# EAGLE design PT08pos (EAGLE 6.6.0)

## Sheet 1 of 2
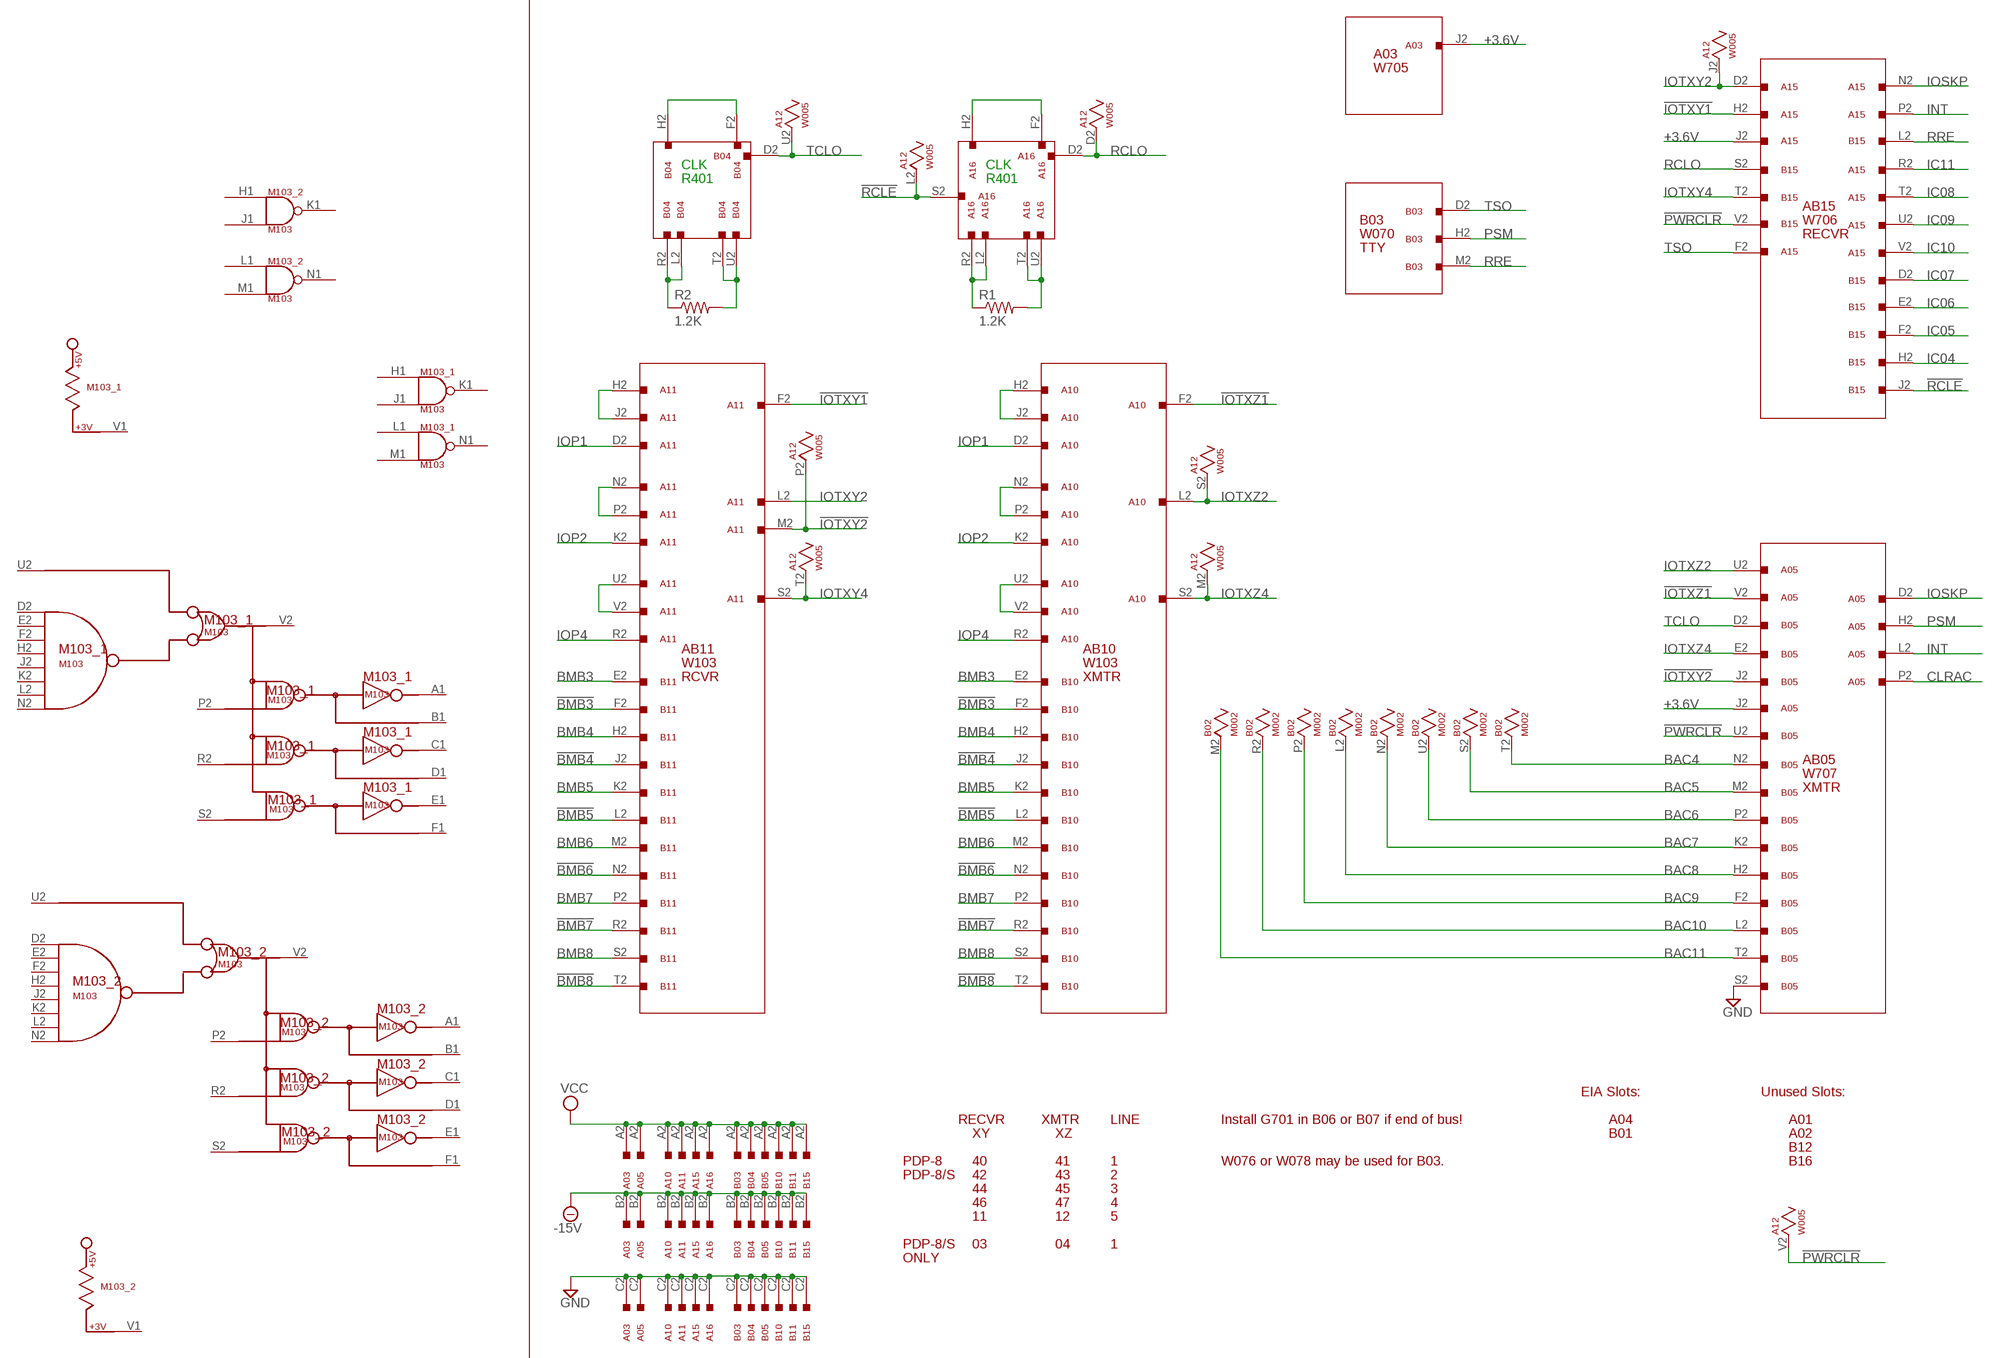
[diagram p0: schematic, sheet 1, part 1 of 2]
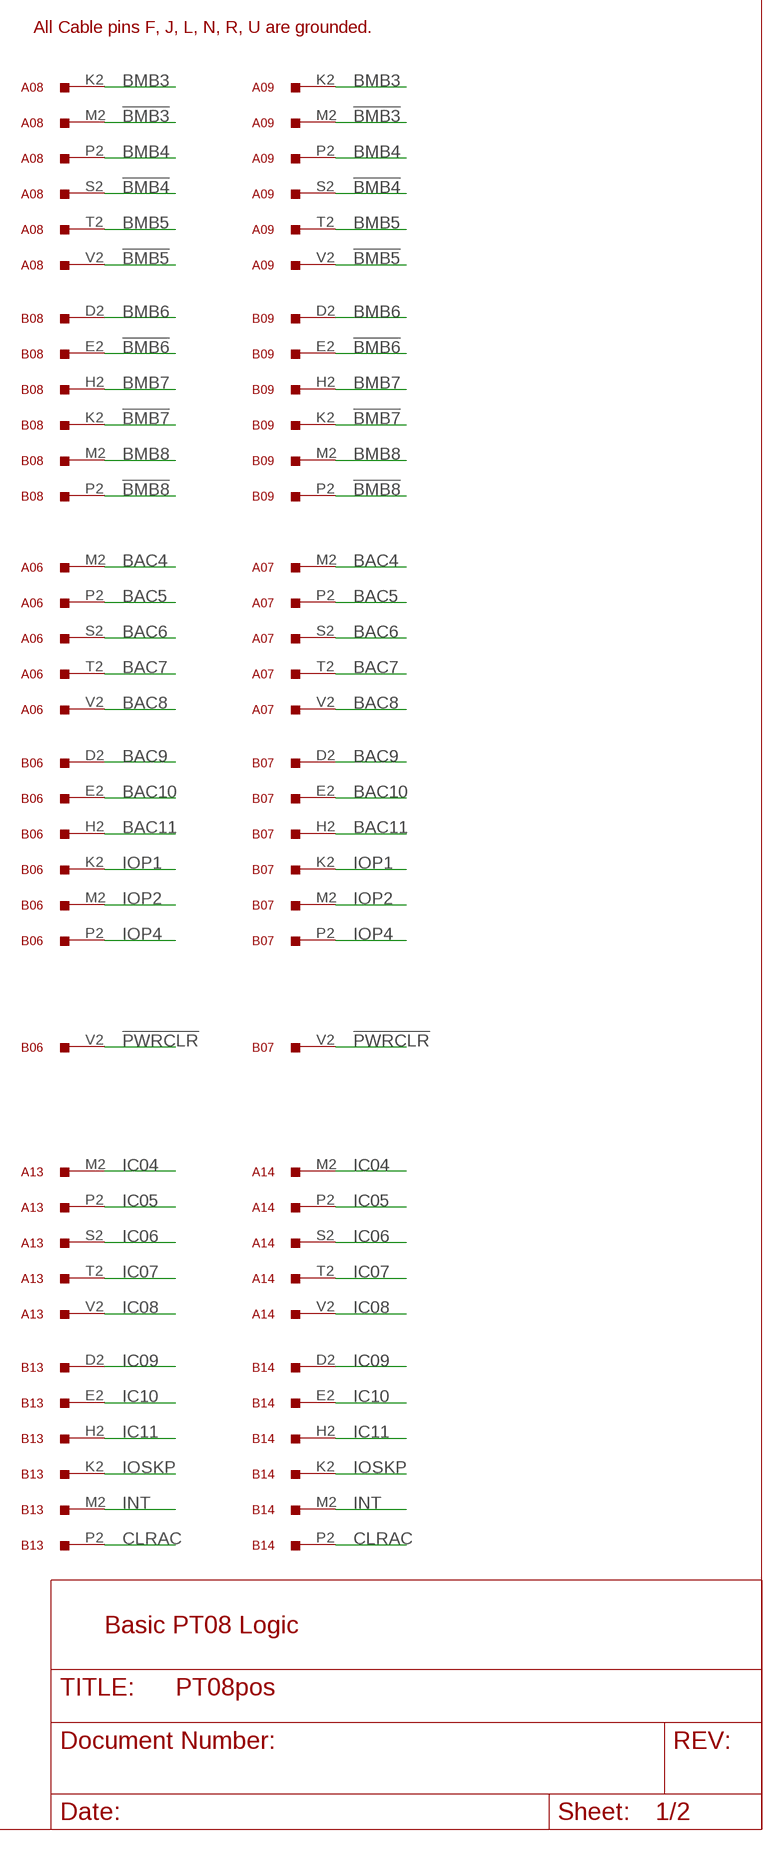
[diagram p1: schematic, sheet 1, part 2 of 2]

### Parts
A01  H807  [H807]
A02  H807  [H807]
A03  W705  W023  [H807]
A05  W707  W023  [H807]
A06  W011  [H807]
A07  W011  [H807]
A08  W011  [H807]
A09  W011  [H807]
A10  W103  W023  [H807]
A11  W103  W023  [H807]
A12  W005  [H807]
A13  W011  [H807]
A14  W011  [H807]
A15  W706  W023  [H807]
A16  R401  W023  [H807]
B02  M002  [H807]
B03  W076  W023  [H807]
B04  R401  W023  [H807]
B05  W707  W023  [H807]
B06  W011  [H807]
B07  W011  [H807]
B08  W011  [H807]
B09  W011  [H807]
B10  W103  W023  [H807]
B11  W103  W023  [H807]
B12  H807  [H807]
B13  W011  [H807]
B14  W011  [H807]
B15  W706  W023  [H807]
B16  H807  [H807]
M103_1  M103  [H807]
M103_2  M103  [H807]
R1  1.2K  R-US_0207/10  [0207/10]
R2  1.2K  R-US_0207/10  [0207/10]

### Nets
!BMB3: A08.M2 A09.M2 B10.F2 B11.F2
!BMB4: A08.S2 A09.S2 B10.J2 B11.J2
!BMB5: A08.V2 A09.V2 B10.L2 B11.L2
!BMB6: B08.E2 B09.E2 B10.N2 B11.N2
!BMB7: B08.K2 B09.K2 B10.R2 B11.R2
!BMB8: B08.P2 B09.P2 B10.T2 B11.T2
!IOTXY1: A11.F2 A15.H2
!IOTXY2: A11.M2 A12.P2 B05.J2
!IOTXZ1: A05.V2 A10.F2
!PWRCLR: A12.V2 B05.U2 B06.V2 B07.V2 B15.V2
!RCLE: A12.L2 A16.S2 B15.J2
+3.6V: A03.J2 A05.J2 A15.J2
-15V [Power]: A03.B2 A05.B2 A10.B2 A11.B2 A15.B2 A16.B2 B03.B2 B04.B2 B05.B2 B10.B2 B11.B2 B15.B2 ; also sheet 2
BAC4: A06.M2 A07.M2 B02.T2 B05.N2
BAC5: A06.P2 A07.P2 B02.S2 B05.M2
BAC6: A06.S2 A07.S2 B02.U2 B05.P2
BAC7: A06.T2 A07.T2 B02.N2 B05.K2
BAC8: A06.V2 A07.V2 B02.L2 B05.H2
BAC9: B02.P2 B05.F2 B06.D2 B07.D2
BAC10: B02.R2 B05.L2 B06.E2 B07.E2
BAC11: B02.M2 B05.T2 B06.H2 B07.H2
BMB3: A08.K2 A09.K2 B10.E2 B11.E2
BMB4: A08.P2 A09.P2 B10.H2 B11.H2
BMB5: A08.T2 A09.T2 B10.K2 B11.K2
BMB6: B08.D2 B09.D2 B10.M2 B11.M2
BMB7: B08.H2 B09.H2 B10.P2 B11.P2
BMB8: B08.M2 B09.M2 B10.S2 B11.S2
CLRAC: A05.P2 B13.P2 B14.P2
GND [Power]: A03.C2 A05.C2 A10.C2 A11.C2 A15.C2 A16.C2 B03.C2 B04.C2 B05.C2 B05.S2 B10.C2 B11.C2 B15.C2 ; also sheet 2
IC04: A13.M2 A14.M2 B15.H2
IC05: A13.P2 A14.P2 B15.F2
IC06: A13.S2 A14.S2 B15.E2
IC07: A13.T2 A14.T2 B15.D2
IC08: A13.V2 A14.V2 A15.T2
IC09: A15.U2 B13.D2 B14.D2
IC10: A15.V2 B13.E2 B14.E2
IC11: A15.R2 B13.H2 B14.H2
INT: A05.L2 A15.P2 B13.M2 B14.M2
IOP1: A10.D2 A11.D2 B06.K2 B07.K2
IOP2: A10.K2 A11.K2 B06.M2 B07.M2
IOP4: A10.R2 A11.R2 B06.P2 B07.P2
IOSKP: A05.D2 A15.N2 B13.K2 B14.K2
IOTXY2: A11.L2 A12.J2 A15.D2
IOTXY4: A11.S2 A12.T2 B15.T2
IOTXZ2: A05.U2 A10.L2 A12.S2
IOTXZ4: A10.S2 A12.M2 B05.E2
N$1: A10.U2 A10.V2
N$2: A16.F2 A16.H2
N$3: A16.L2 A16.R2 R1.1
N$4: A16.T2 A16.U2 R1.2
N$5: A10.H2 A10.J2
N$6: B04.F2 B04.H2
N$7: B04.L2 B04.R2 R2.1
N$8: B04.T2 B04.U2 R2.2
N$9: A11.U2 A11.V2
N$10: A11.H2 A11.J2
N$11: A10.N2 A10.P2
N$12: A11.N2 A11.P2
PSM: A05.H2 B03.H2 ; also sheet 2
RCLO: A12.D2 A16.D2 B15.S2
RRE: B03.M2 B15.L2
TCLO: A12.U2 B04.D2 B05.D2
TSO: A15.F2 B03.D2 ; also sheet 2
VCC [Power]: A03.A2 A05.A2 A10.A2 A11.A2 A15.A2 A16.A2 B03.A2 B04.A2 B05.A2 B10.A2 B11.A2 B15.A2 ; also sheet 2
Unconnected: A03.D2 A03.E2 A03.F2 A03.H2 A03.K2 A03.L2 A03.M2 A03.N2 A03.P2 A03.R2 A03.S2 A03.T2 A03.U2 A03.V2 A05.E2 A05.F2 A05.K2 A05.M2 A05.N2 A05.R2 A05.S2 A05.T2 A06.D2 A06.E2 A06.H2 A06.K2 A07.D2 A07.E2 A07.H2 A07.K2 A08.D2 A08.E2 A08.H2 A09.D2 A09.E2 A09.H2 A10.E2 A10.M2 A10.T2 A11.E2 A11.T2 A12.E2 A12.F2 A12.H2 A12.K2 A12.N2 A12.R2 A13.D2 A13.E2 A13.H2 A13.K2 A14.D2 A14.E2 A14.H2 A14.K2 A15.E2 A15.K2 A15.L2 A15.M2 A15.S2 A16.E2 A16.J2 A16.K2 A16.M2 A16.N2 A16.P2 A16.V2 B02.F2 B02.H2 B02.J2 B02.K2 B02.V2 B03.F2 B03.J2 B03.L2 B03.N2 B03.R2 B03.S2 B03.T2 B03.U2 B03.V2 B04.E2 B04.J2 B04.K2 B04.M2 B04.N2 B04.P2 B04.S2 B04.V2 B05.R2 B05.V2 B06.S2 B06.T2 B07.S2 B07.T2 B08.S2 B08.T2 B08.V2 B09.S2 B09.T2 B09.V2 B10.D2 B10.U2 B10.V2 B11.D2 B11.U2 B11.V2 B13.S2 B13.T2 B13.V2 B14.S2 B14.T2 B14.V2 B15.K2 B15.M2 B15.N2 B15.P2 B15.R2 B15.U2 M103_1.A1(V2:A1) M103_1.B1(V2:B1) M103_1.C1(V2:C1) M103_1.D1(V2:D1) M103_1.D2(V2:D2) M103_1.E1(V2:E1) M103_1.E2(V2:E2) M103_1.F1(V2:F1) M103_1.F2(V2:F2) M103_1.H1(K1:IN1) M103_1.H2(V2:H2) M103_1.J1(K1:IN2) M103_1.J2(V2:J2) M103_1.K1(K1:OUT) M103_1.K2(V2:K2) M103_1.L1(N1:IN1) M103_1.L2(V2:L2) M103_1.M1(N1:IN2) M103_1.N1(N1:OUT) M103_1.N2(V2:N2) M103_1.P2(V2:P2) M103_1.R2(V2:R2) M103_1.S2(V2:S2) M103_1.U2(V2:U2) M103_1.V1 M103_1.V2(V2:V2) M103_2.A1(V2:A1) M103_2.B1(V2:B1) M103_2.C1(V2:C1) M103_2.D1(V2:D1) M103_2.D2(V2:D2) M103_2.E1(V2:E1) M103_2.E2(V2:E2) M103_2.F1(V2:F1) M103_2.F2(V2:F2) M103_2.H1(K1:IN1) M103_2.H2(V2:H2) M103_2.J1(K1:IN2) M103_2.J2(V2:J2) M103_2.K1(K1:OUT) M103_2.K2(V2:K2) M103_2.L1(N1:IN1) M103_2.L2(V2:L2) M103_2.M1(N1:IN2) M103_2.N1(N1:OUT) M103_2.N2(V2:N2) M103_2.P2(V2:P2) M103_2.R2(V2:R2) M103_2.S2(V2:S2) M103_2.U2(V2:U2) M103_2.V1 M103_2.V2(V2:V2)

### Notes on the sheet
- All Cable pins F, J, L, N, R, U are grounded.
- A03
- W705
- CLK | CLK
- R401 | R401
- AB15
- B03 | W706
- W070 | RECVR
- TTY
- AB11 | AB10
- W103 | W103
- RCVR | XMTR
- AB05
- W707
- XMTR
- EIA Slots: | Unused Slots:
- RECVR | XMTR | LINE | Install G701 in B06 or B07 if end of bus! | A04
- XY | XZ | B01
- PDP-8 | 40 | 41 | 1 | W076 or W078 may be used for B03.
- PDP-8/S | 42 | 43 | 2
- 44 | 45 | 3
- 46 | 47 | 4
- 11 | 12 | 5 | Basic PT08 Logic
- PDP-8/S | 03 | 04 | 1
- ONLY

## Sheet 2 of 2
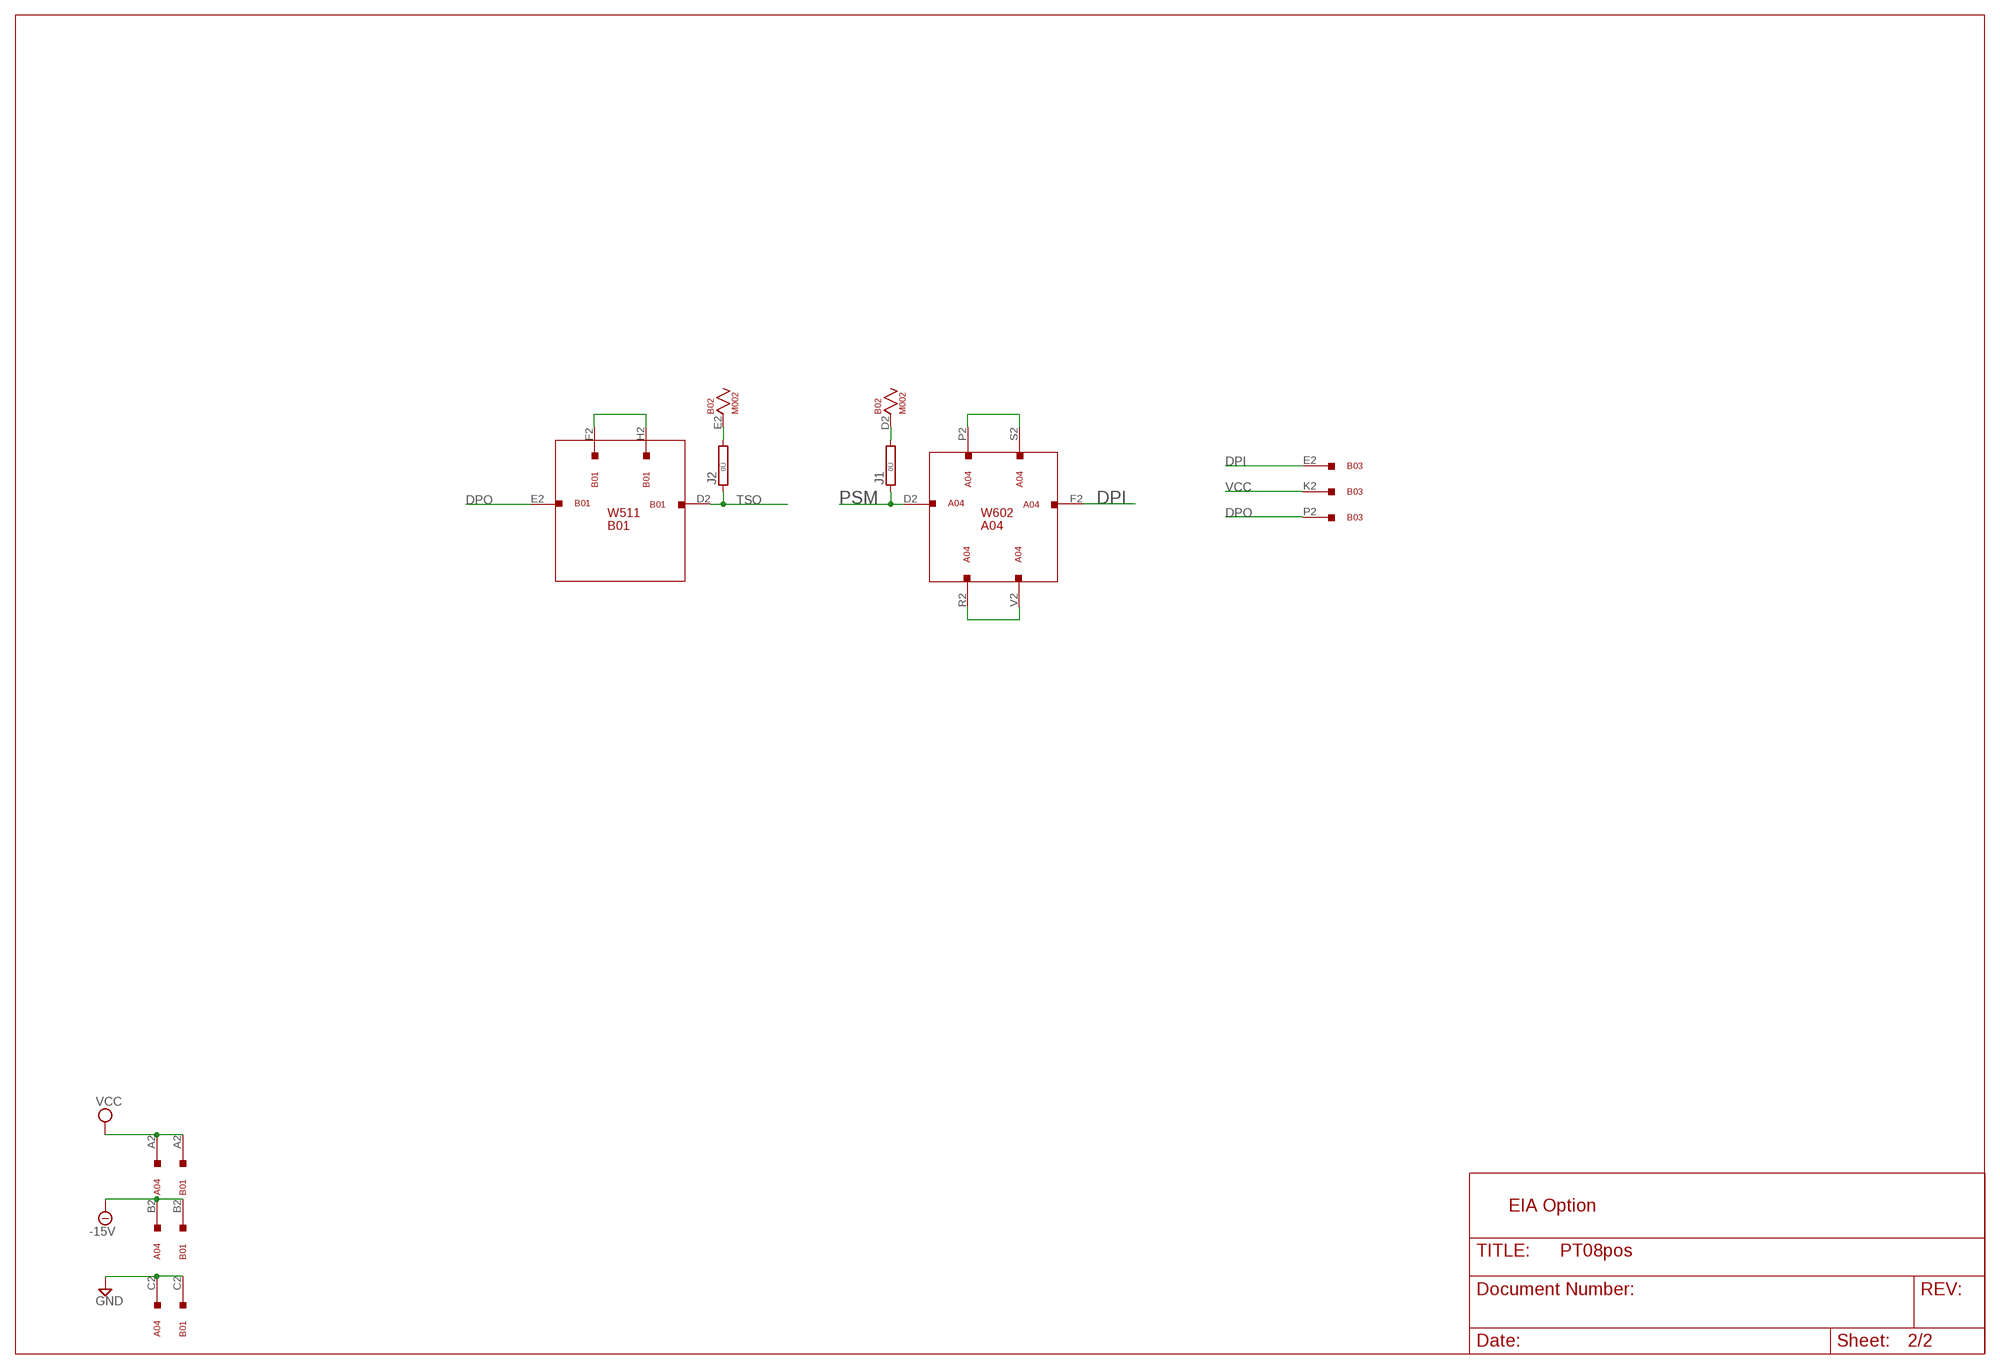
[diagram p2: schematic, sheet 2]

### Parts
A04  W602  W023  [H807]
B01  W511  W023  [H807]
J1  0R  [0R/10]
J2  0R  [0R/10]

### Nets
-15V [Power]: A04.B2 B01.B2 ; also sheet 1
DPI: A04.F2 B03.E2
DPO: B01.E2 B03.P2
GND [Power]: A04.C2 B01.C2 ; also sheet 1
N$13: A04.P2 A04.S2
N$14: A04.R2 A04.V2
N$15: B02.D2 J1.2
N$16: B01.F2 B01.H2
N$17: B02.E2 J2.2
PSM: A04.D2 J1.1 ; also sheet 1
TSO: B01.D2 J2.1 ; also sheet 1
VCC [Power]: A04.A2 B01.A2 B03.K2 ; also sheet 1
Unconnected: A04.E2 A04.H2 A04.J2 A04.K2 A04.L2 A04.M2 A04.N2 A04.T2 A04.U2 B01.J2 B01.K2 B01.L2 B01.M2 B01.N2 B01.P2 B01.R2 B01.S2 B01.T2 B01.U2 B01.V2

### Notes on the sheet
- W511 | W602
- B01 | A04
- EIA Option

## Power pins joined to a net without a drawn wire
-15V: A12.B2(-15V)
GND: A06.C2 A06.F2 A06.J2 A06.L2 A06.N2 A06.R2 A06.U2 A07.C2 A07.F2 A07.J2 A07.L2 A07.N2 A07.R2 A07.U2 A08.C2 A08.F2 A08.J2 A08.L2 A08.N2 A08.R2 A08.U2 A09.C2 A09.F2 A09.J2 A09.L2 A09.N2 A09.R2 A09.U2 A12.C2(GND) A13.C2 A13.F2 A13.J2 A13.L2 A13.N2 A13.R2 A13.U2 A14.C2 A14.F2 A14.J2 A14.L2 A14.N2 A14.R2 A14.U2 B02.C2(GND) B06.C2 B06.F2 B06.J2 B06.L2 B06.N2 B06.R2 B06.U2 B07.C2 B07.F2 B07.J2 B07.L2 B07.N2 B07.R2 B07.U2 B08.C2 B08.F2 B08.J2 B08.L2 B08.N2 B08.R2 B08.U2 B09.C2 B09.F2 B09.J2 B09.L2 B09.N2 B09.R2 B09.U2 B13.C2 B13.F2 B13.J2 B13.L2 B13.N2 B13.R2 B13.U2 B14.C2 B14.F2 B14.J2 B14.L2 B14.N2 B14.R2 B14.U2 M103_1.C2(GND) M103_1.T1(GND) M103_2.C2(GND) M103_2.T1(GND)
VCC: A12.A2(VCC) B02.A2(VCC) M103_1.A2(VCC) M103_2.A2(VCC)

## Library data of the parts
A01 A02 B12 B16 = dec-m:H807: Empty card slot
A03-A05 A10 A11 A15 A16 B01 B03-B05 B10 B11 B15 = dec-m:W023: One-sided 18 pin connector/cable.
A06-A09 A13 A14 B06-B09 B13 B14 = dec-m:W011: One-sided 9 pin connector/cable with grounds (Negibus).
A12 = dec-m:W005: 15 Clamped Loads
B02 = dec-m:M002: 15 Clamped Loads
J1 J2 = jumper:0R: Bridge 0R 10mm
M103_1 M103_2 = dec-m:M103: M103 Device Selector Used to decode IOT requests.
R1 R2 = rcl:R-US_: RESISTOR, American symbol

## Net classes
1 Power: width 0.508 mm

## Board
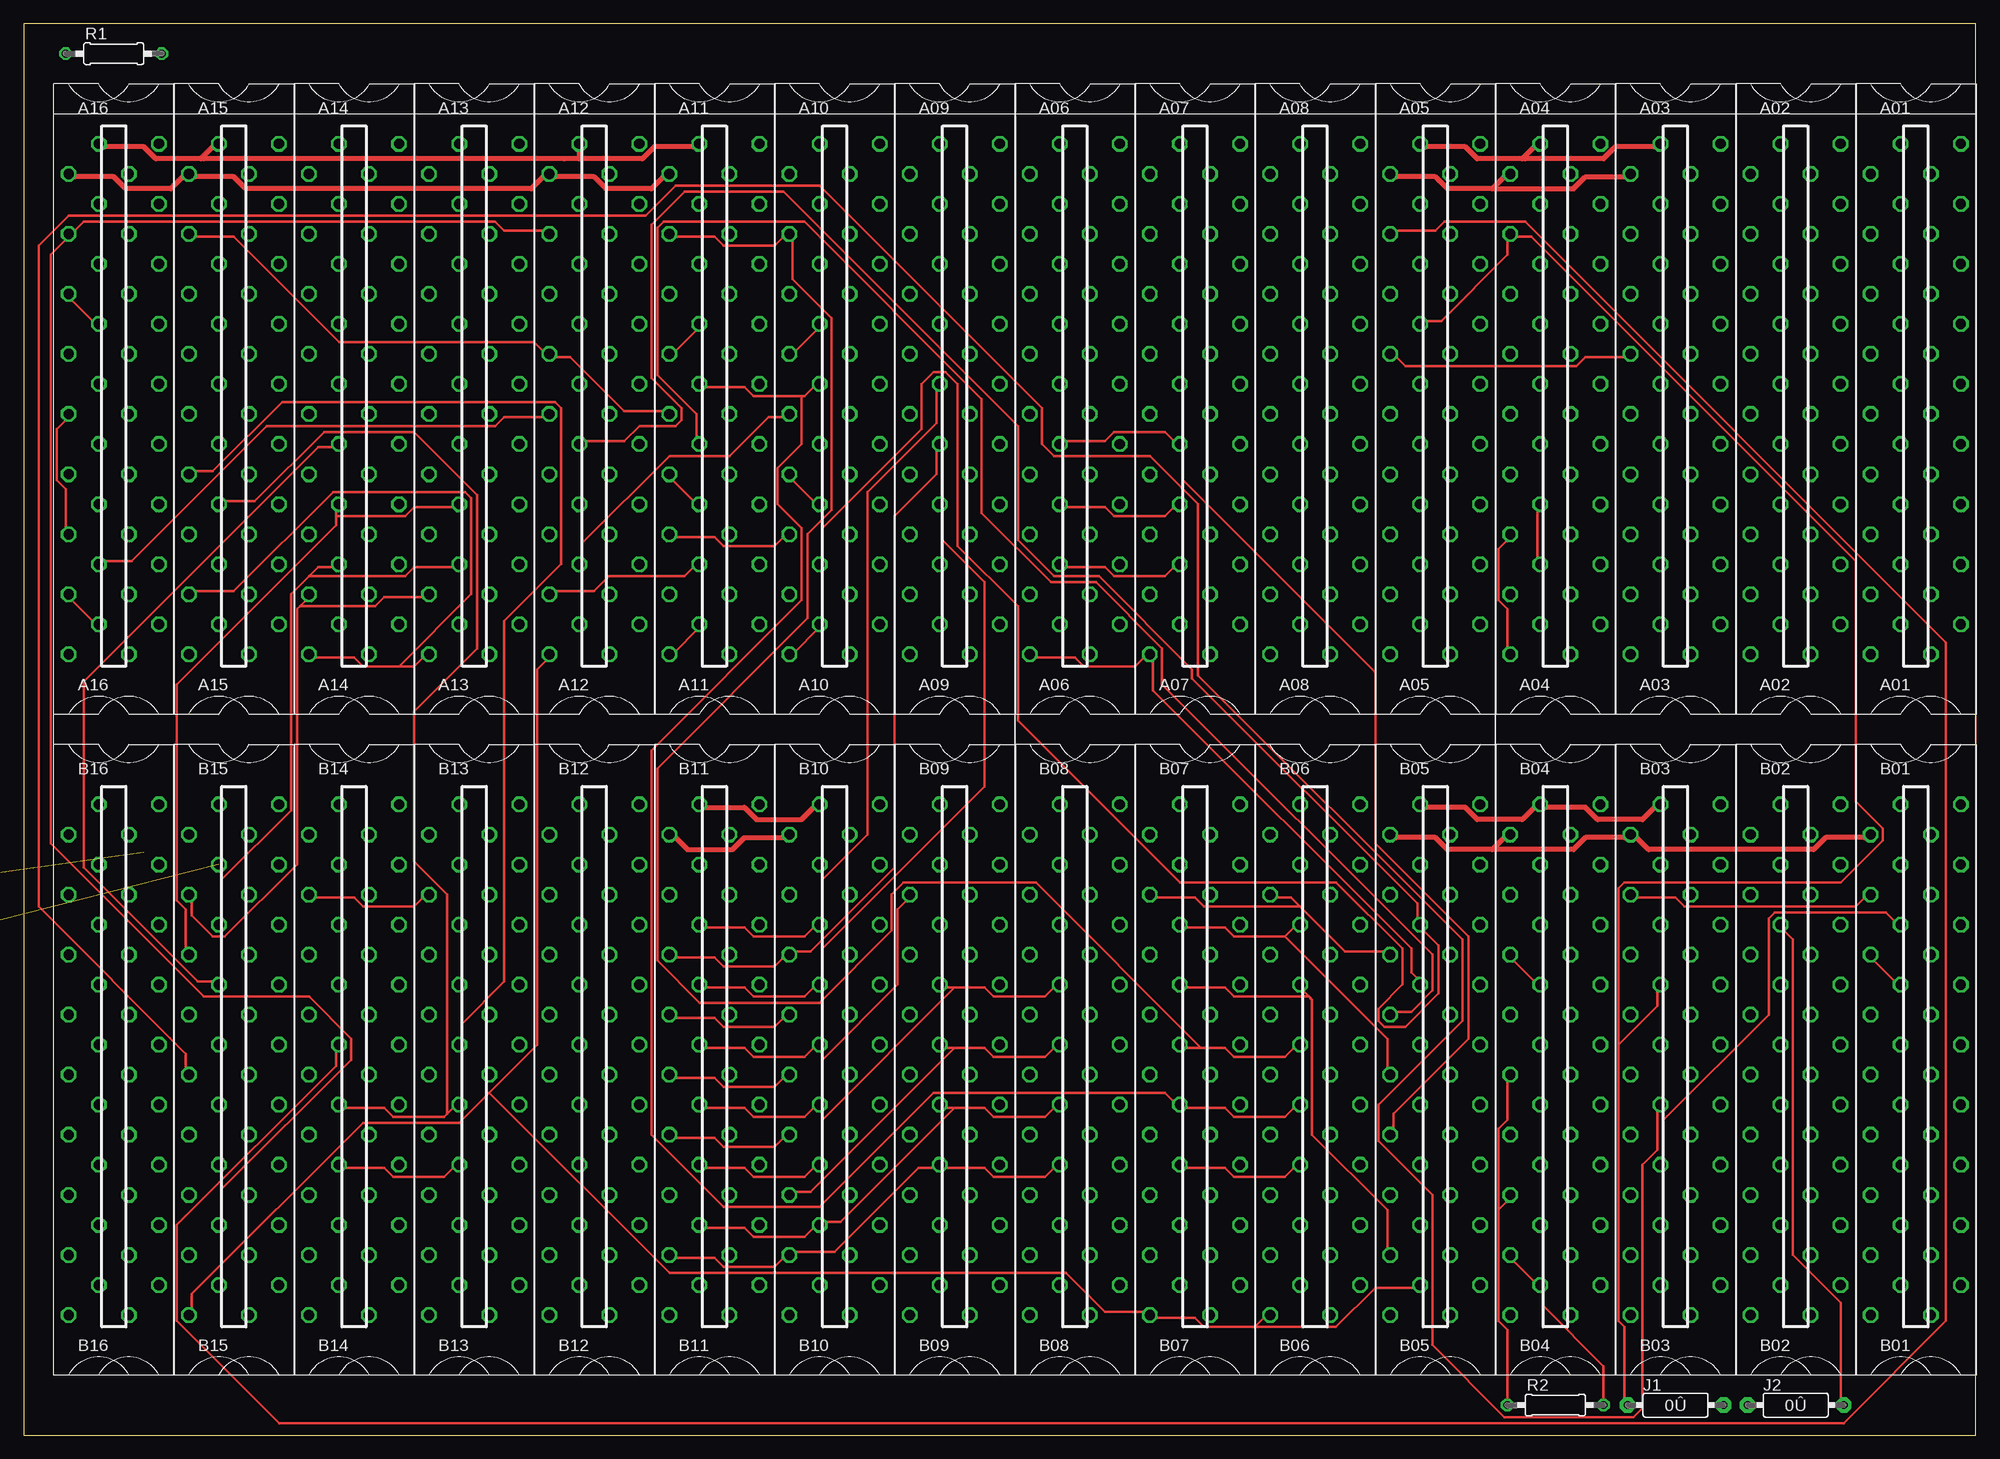
[diagram p3: board, top side]
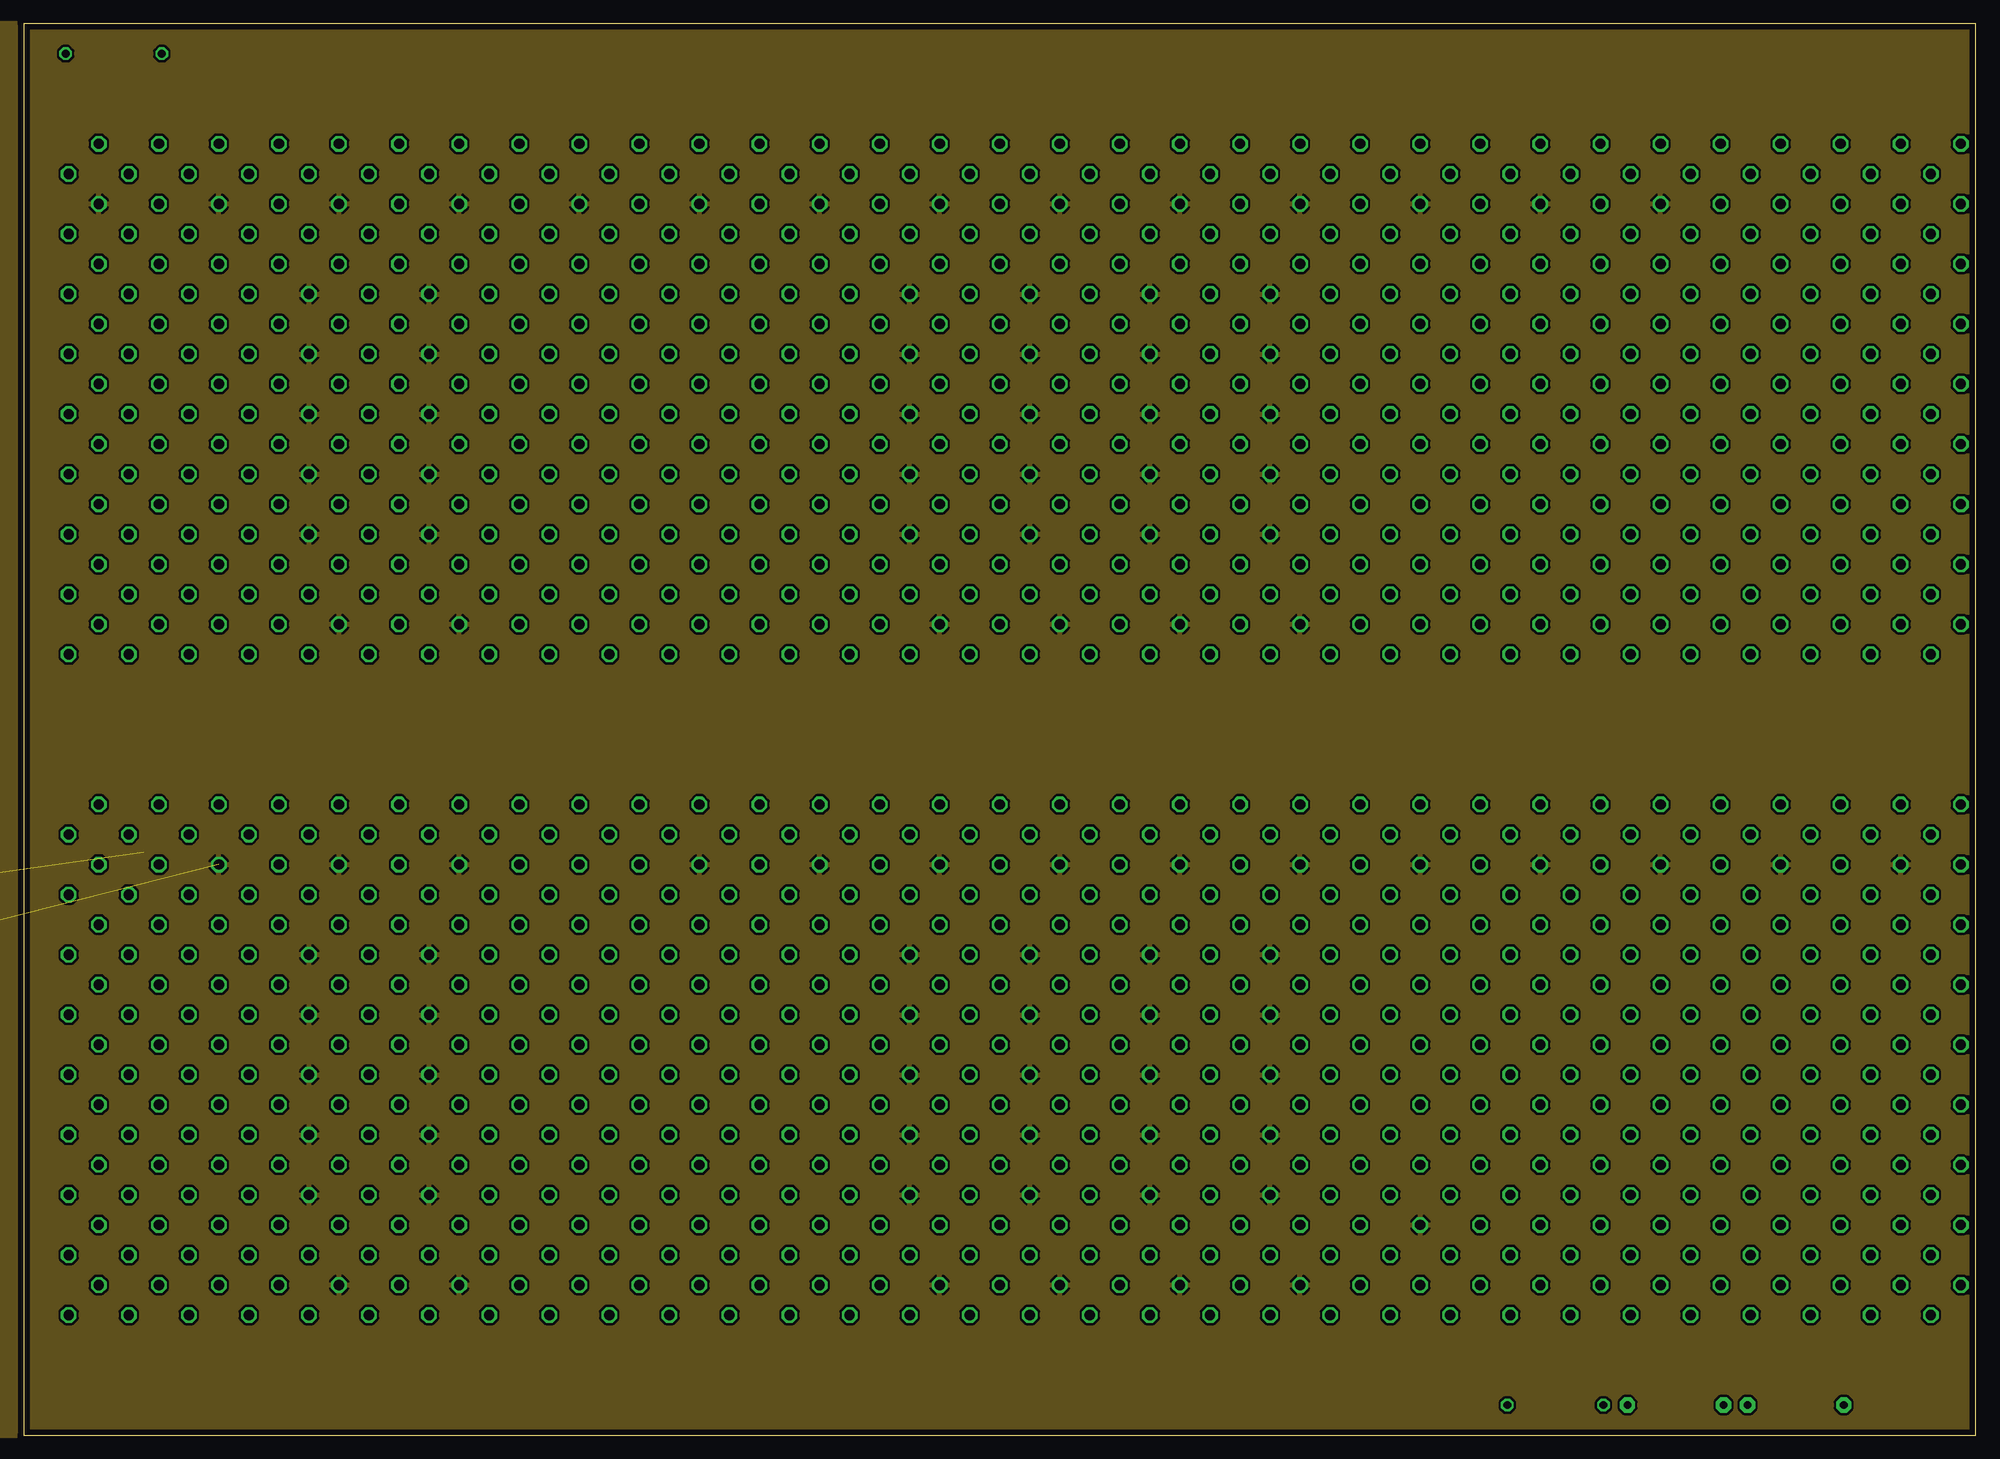
[diagram p4: board, inner layer GND$]
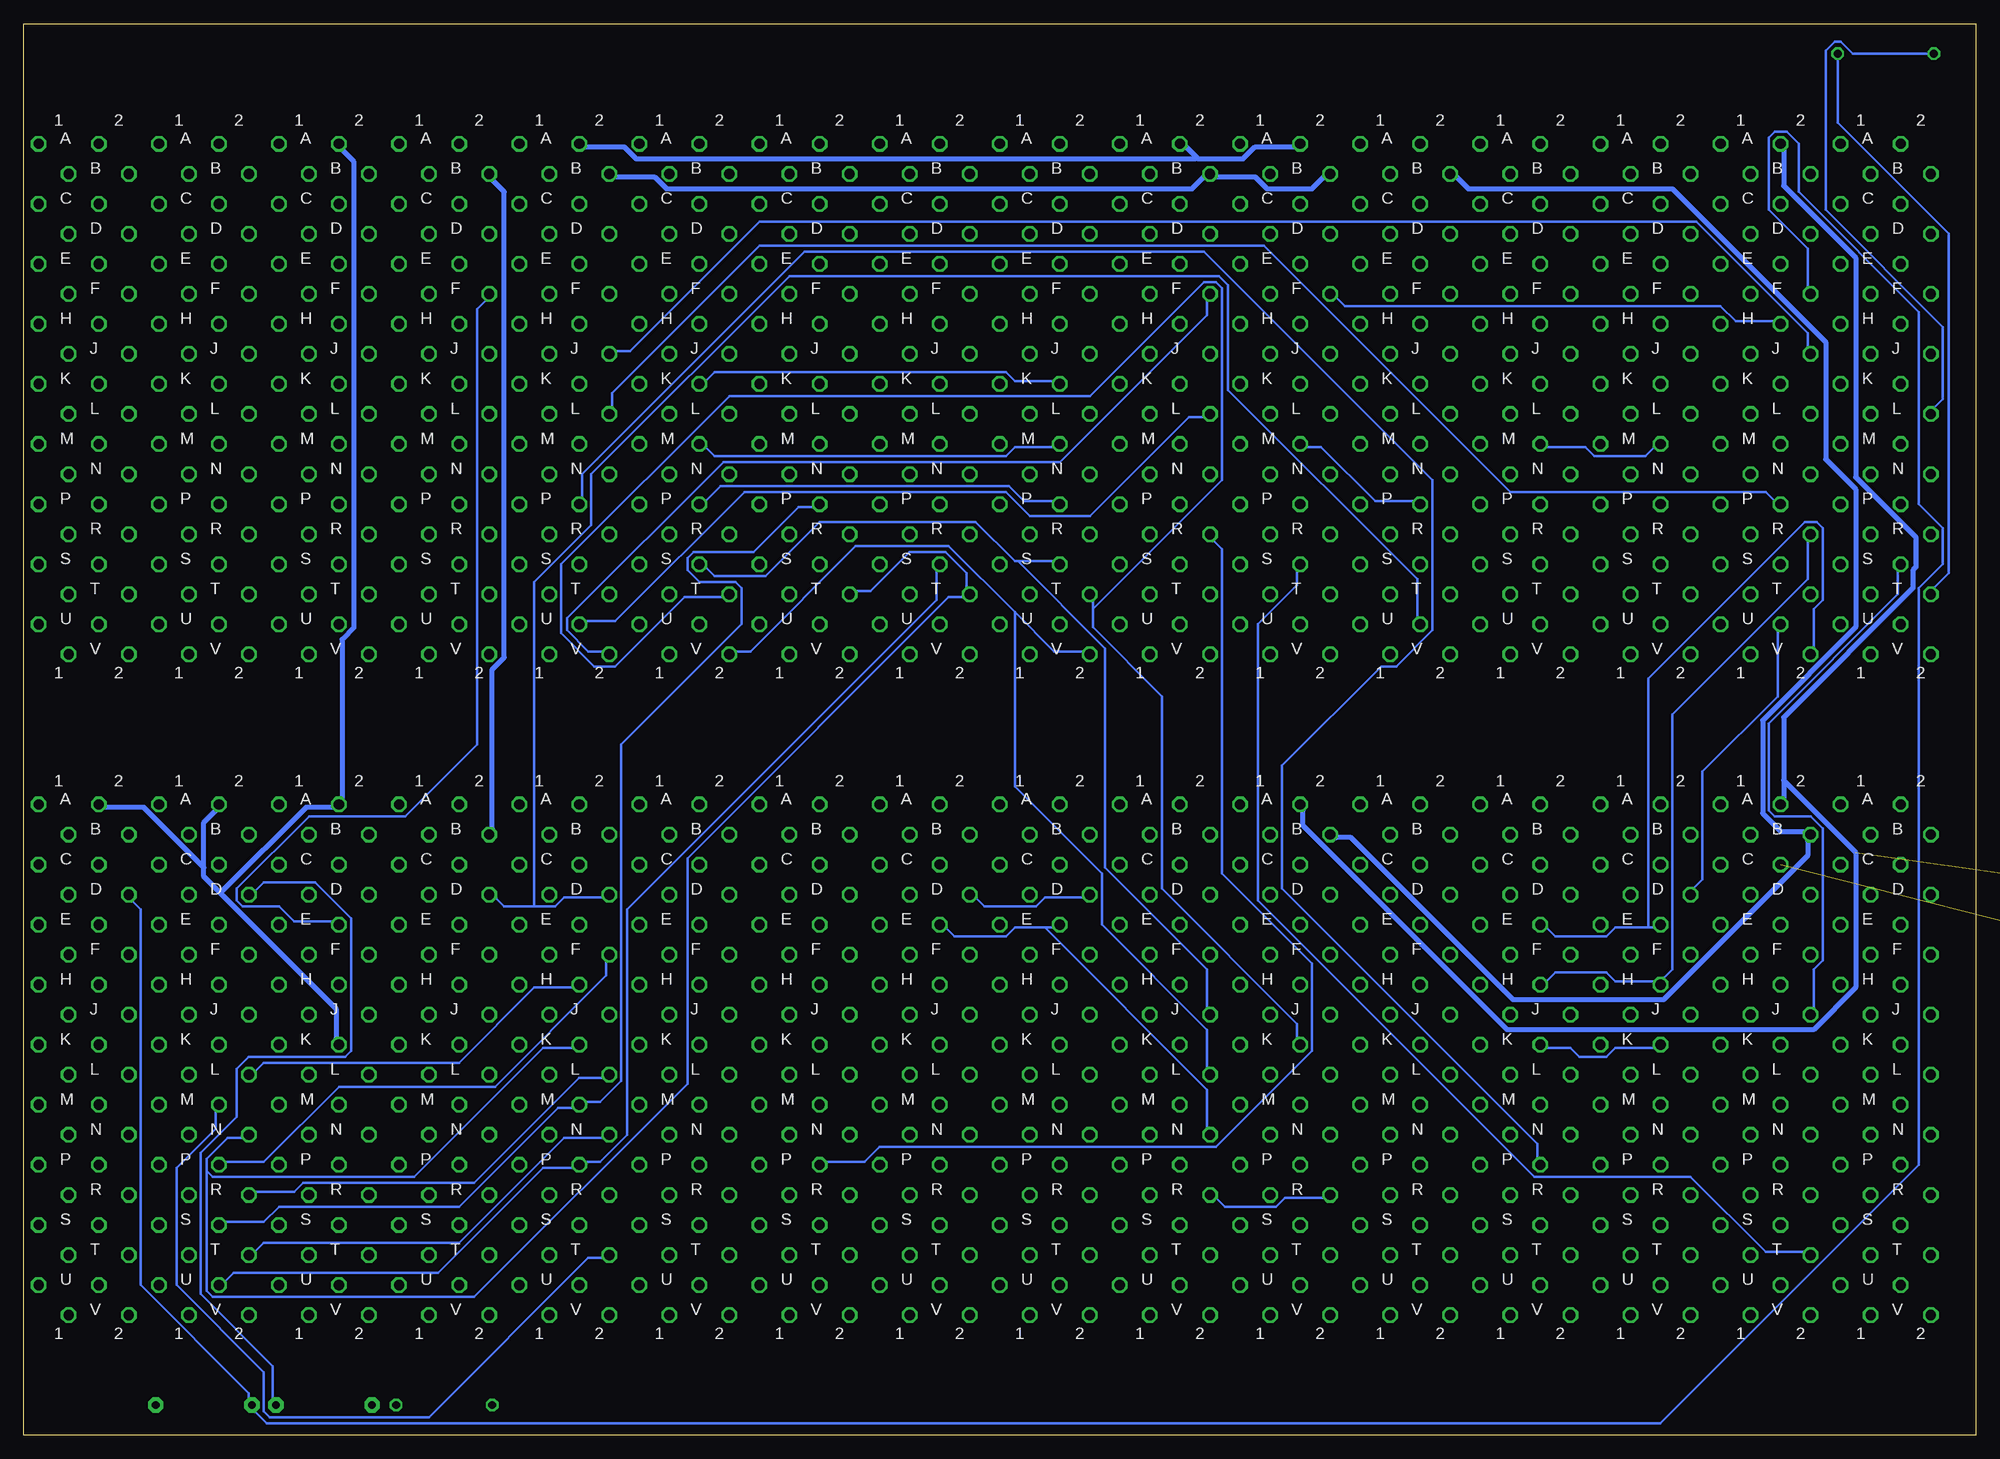
[diagram p5: board, bottom side, seen from below]

Size 206.38 x 149.22 mm. Coordinates in mm from the lower left corner, seen from the top.
Outline: 0,0 206.38,0 206.38,149.22 0,149.22 0,0
Copper layers (1*2*16): Top 0.035mm / dielectric 1.5mm / GND$ 0.035mm / dielectric 0.15mm / Bottom 0.035mm
Design rules "10mils *": minimum track width 10mil, minimum drill 24mil, track to track 10mil, track to pad 10mil, pad to pad 10mil, via to via 10mil, smd to smd 10mil, copper to edge 25mil, drill to drill 10mil, minimum pad ring 10mil, minimum via ring 8mil, stop-mask expansion 0mil, vias tented up to drill 0mil, thermal gap 10mil

### Footprints (pad centres in the part's own frame; a part is rotated, then mirrored left to right if it is on the bottom)
H807 = drill 1.092 octagon: A1 4.763,28.575; A2 -1.587,28.575; B1 1.587,25.4; B2 -4.763,25.4; C1 4.763,22.225; C2 -1.587,22.225; D1 1.587,19.05; D2 -4.763,19.05; E1 4.763,15.875; E2 -1.587,15.875; F1 1.587,12.7; F2 -4.763,12.7; H1 4.763,9.525; H2 -1.587,9.525; J1 1.587,6.35; J2 -4.763,6.35; K1 4.763,3.175; K2 -1.587,3.175; L1 1.587,0; L2 -4.763,0; M1 4.763,-3.175; M2 -1.587,-3.175; N1 1.587,-6.35; N2 -4.763,-6.35; P1 4.763,-9.525; P2 -1.587,-9.525; R1 1.587,-12.7; R2 -4.763,-12.7; S1 4.763,-15.875; S2 -1.587,-15.875; T1 1.587,-19.05; T2 -4.763,-19.05; U1 4.763,-22.225; U2 -1.587,-22.225; V1 1.587,-25.4; V2 -4.763,-25.4
0R/10 = drill 0.813 pad 1.6 octagon: 1 -5.08,0; 2 5.08,0
0207/10 = drill 0.813 octagon: 1 -5.08,0; 2 5.08,0

### Placement (x,y rotation side)
A01  200.03,107.95 0 top
A02  187.32,107.95 0 top
A03  174.62,107.95 0 top
A04  161.93,107.95 0 top
A05  149.22,107.95 0 top
A06  111.12,107.95 0 top
A07  123.83,107.95 0 top
A08  136.53,107.95 0 top
A09  98.42,107.95 0 top
A10  85.72,107.95 0 top
A11  73.03,107.95 0 top
A12  60.33,107.95 0 top
A13  47.62,107.95 0 top
A14  34.92,107.95 0 top
A15  22.23,107.95 0 top
A16  9.53,107.95 0 top
B01  200.03,38.1 0 top
B02  187.32,38.1 0 top
B03  174.62,38.1 0 top
B04  161.93,38.1 0 top
B05  149.22,38.1 0 top
B06  136.53,38.1 0 top
B07  123.83,38.1 0 top
B08  111.12,38.1 0 top
B09  98.42,38.1 0 top
B10  85.72,38.1 0 top
B11  73.03,38.1 0 top
B12  60.33,38.1 0 top
B13  47.62,38.1 0 top
B14  34.92,38.1 0 top
B15  22.23,38.1 0 top
B16  9.53,38.1 0 top
J1  174.62,3.17 0 top
J2  187.32,3.17 0 top
M103_1  -12.7,29.21 0 top  (outside the outline)
M103_2  -35.56,29.21 0 top  (outside the outline)
R1  9.53,146.05 0 top
R2  161.93,3.17 0 top
U$1  [CBLOCK]  3.17,6.35 0 top
U$2  [CBLOCK]  53.98,6.35 0 top
U$3  [CBLOCK]  104.78,6.35 0 top
U$4  [CBLOCK]  155.57,6.35 0 top

### Tracks (layer width: path | path; a pad name or v marks a point on that pad's centre or on a via)
!BMB3
  Top 0.254: B11.F2 68.9,50.48 73.03,50.48 73.98,49.53 79.38,49.53 80.33,50.48 B10.F2 81.6,51.12 83.19,51.12 92.08,60.01 92.08,97.16 96.52,101.6 96.52,104.14 A09.M2
  Bottom 0.254: A09.M2 97.47,104.46 101.6,104.46 102.55,103.5 133.35,103.5 134.3,104.46 A08.M2
!BMB4
  Top 0.254: B11.J2 68.9,44.13 73.03,44.13 73.98,43.18 79.38,43.18 80.33,44.13 B10.J2
  Bottom 0.254: 101.28,92.39 101.6,92.39 105.73,96.52 122.24,96.52 127.95,90.81 133.35,90.81 134.3,91.76 A08.S2 | 101.28,92.39 97.47,92.39 A09.S2 | 101.28,92.39 92.08,83.19 92.08,60.01 81.28,49.21 81.28,45.09 B10.J2
!BMB5
  Top 0.254: B11.L2 68.9,37.78 73.03,37.78 73.98,36.83 79.38,36.83 80.33,37.78 B10.L2
  Bottom 0.254: 101.6,87 108.58,93.98 118.43,93.98 129.54,82.87 131.13,82.87 A08.V2 | 101.6,87 97.47,82.87 94.3,82.87 A09.V2 | 101.6,87 101.6,68.58 92.39,59.37 92.39,53.98 81.28,42.86 81.28,38.73 B10.L2
!BMB6
  Top 0.254: B11.N2 68.9,31.43 73.03,31.43 73.98,30.48 79.38,30.48 80.33,31.43 B10.N2
  Bottom 0.254: 98.42,53.66 101.6,53.66 102.55,52.7 107.95,52.7 108.9,53.66 B08.E2 | 98.42,53.66 97.47,53.66 B09.E2 | 98.42,53.66 81.28,36.51 81.28,32.38 B10.N2
!BMB7
  Top 0.254: 98.42,40.96 101.6,40.96 102.55,40.01 107.95,40.01 108.9,40.96 B08.K2 | 98.42,40.96 97.47,40.96 B09.K2 | 98.42,40.96 83.19,25.72 81.6,25.72 B10.R2
  Bottom 0.254: B11.R2 68.9,25.08 73.03,25.08 73.98,24.13 79.38,24.13 80.33,25.08 B10.R2
!BMB8
  Top 0.254: B11.T2 68.9,18.73 73.03,18.73 73.98,17.78 79.38,17.78 80.33,18.73 B10.T2 81.6,19.37 85.72,19.37 94.61,28.26 96.2,28.26 B09.P2 97.47,28.26 101.6,28.26 102.55,27.3 107.95,27.3 108.9,28.26 B08.P2
!IOTXY1
  Bottom 0.254: A15.H2 21.27,117.79 25.4,117.79 26.99,119.38 66.67,119.38 67.63,120.33 A11.F2
!IOTXY2
  Top 0.254: B05.J2 145.1,44.77 146.69,44.77 148.91,46.99 148.91,50.8 120.33,79.38 120.33,83.19 113.35,90.17 108.58,90.17 101.28,97.47 101.28,109.54 82.55,128.27 67.63,128.27 66.99,127.64 66.99,112.08 71.12,107.95 71.12,105.41 A11.M2
  Bottom 0.254: A12.P2 59.37,98.74 63.5,98.74 69.22,104.46 70.8,104.46 A11.M2
!IOTXZ1
  Bottom 0.254: A10.F2 81.28,120.02 81.28,118.43 96.84,102.87 132.4,102.87 148.91,86.36 148.91,85.09 146.69,82.87 145.1,82.87 A05.V2
!PWRCLR
  Top 0.254: 130.18,11.43 124.78,11.43 123.83,12.38 119.7,12.38 B07.V2 118.43,13.02 114.3,13.02 110.17,17.14 68.26,17.14 49.21,36.2 | 130.18,11.43 131.13,12.38 B06.V2 | 130.18,11.43 138.75,11.43 142.88,15.56 147,15.56 B05.U2 | 49.21,36.2 54.29,41.27 54.29,80.96 55.24,81.92 A12.V2 | 49.21,36.2 46.04,33.02 35.88,33.02 17.78,14.92 17.78,13.34 B15.V2
!RCLE
  Top 0.254: A12.L2 54.93,107.63 50.8,107.63 49.85,106.68 25.72,106.68 11.43,92.39 8.57,92.39 A16.S2
  Bottom 0.254: B15.J2 17.14,45.09 17.14,49.21 16.19,50.16 16.19,64.14 17.46,65.41 21.27,65.41 21.91,66.04 21.91,75.25 8.26,88.9 8.26,91.44 A16.S2
+3.6V
  Top 0.254: A03.J2 169.23,113.98 165.1,113.98 164.15,113.03 146.05,113.03 145.1,113.98 A05.J2
  Bottom 0.254: A15.J2 17.78,114.94 17.78,116.52 29.53,128.27 128.59,128.27 142.24,114.62 143.83,114.62 A05.J2
-15V
  Top 0.508: B10.B2 80.33,63.18 76.2,63.18 74.93,61.91 70.17,61.91 68.9,63.18 B11.B2 | 155.42,62.07 156.53,63.18 B04.B2 | 155.42,62.07 155.26,61.91 150.5,61.91 149.22,63.18 145.1,63.18 B05.B2 | 155.42,62.07 155.57,61.91 163.83,61.91 165.1,63.18 169.23,63.18 B03.B2 170.5,63.18 171.77,61.91 189.23,61.91 190.5,63.18 194.63,63.18 B01.B2 | 155.42,131.92 156.53,133.03 A04.B2 | 155.42,131.92 155.26,131.76 150.5,131.76 149.22,133.03 145.1,133.03 A05.B2 | A03.B2 169.23,133.03 165.1,133.03 163.83,131.76 155.57,131.76 155.42,131.92 | A16.B2 5.4,133.03 9.53,133.03 10.79,131.76 15.56,131.76 16.83,133.03 A15.B2 18.1,133.03 22.23,133.03 23.5,131.76 53.66,131.76 54.93,133.03 A12.B2 56.2,133.03 60.33,133.03 61.59,131.76 66.36,131.76 67.63,133.03 A11.B2
  Bottom 0.508: B11.B2 67.63,63.18 66.04,63.18 48.9,46.04 33.02,46.04 17.78,61.28 17.78,62.87 B15.B2 18.1,63.82 20.64,63.82 22.54,65.72 22.54,75.56 12.7,85.41 12.7,100.01 15.88,103.19 15.88,115.57 32.07,131.76 53.66,131.76 54.93,133.03 A12.B2 | A11.B2 68.9,133.03 70.17,131.76 74.93,131.76 76.2,133.03 80.33,133.03 A10.B2 81.6,133.03 82.87,131.76 138.43,131.76 139.7,133.03 143.83,133.03 A05.B2 | B04.B2 156.84,64.14 156.84,80.96 155.57,82.23 155.57,131.44 156.84,132.72 A04.B2
BAC4
  Top 0.254: A06.M2 110.17,105.09 114.3,105.09 115.25,106.05 120.65,106.05 121.6,105.09 A07.M2 122.56,104.14 122.56,100.97 142.88,80.64 142.88,62.55 152.72,52.7 152.72,41.91 144.78,33.97 144.78,32.38 B05.N2
  Bottom 0.254: B05.N2 145.1,31.43 149.22,31.43 160.34,20.32 180.97,20.32 181.93,19.37 B02.T2
BAC5
  Top 0.254: A06.P2 110.17,98.11 114.3,98.11 115.25,97.16 120.65,97.16 121.6,98.11 A07.P2
  Bottom 0.254: B02.S2 185.1,22.54 180.97,22.54 179.39,24.13 160.34,24.13 149.86,34.61 148.27,34.61 B05.M2 147,35.24 145.41,35.24 143.19,37.47 143.19,73.03 130.49,85.72 130.49,89.53 131.13,90.17 134.94,90.17 136.21,91.44 136.21,92.71 135.57,93.34 129.22,93.34 124.46,98.11 122.87,98.11 A07.P2
BAC6
  Top 0.254: A06.S2 110.17,91.76 114.3,91.76 115.25,90.81 120.65,90.81 121.6,91.76 A07.S2
  Bottom 0.254: B02.U2 185.1,16.19 184.15,17.14 162.56,17.14 151.45,28.26 148.27,28.26 B05.P2 147,28.89 145.41,28.89 142.56,31.75 142.56,55.56 109.86,88.27 109.86,91.44 A06.S2
BAC7
  Bottom 0.254: A07.T2 118.43,89.22 116.84,89.22 112.71,93.34 108.9,93.34 106.68,91.12 106.68,89.53 A06.T2 107,88.58 108.58,88.58 136.21,60.96 136.21,37.15 158.75,14.61 186.37,14.61 187.01,15.24 187.01,27.94 | 187.01,27.94 186.37,27.3 165.1,27.3 151.45,40.96 148.27,40.96 B05.K2 | 187.01,27.94 187.01,29.21 184.78,31.43 183.2,31.43 B02.N2
BAC8
  Top 0.254: A06.V2 107,82.23 111.12,82.23 112.08,81.28 117.47,81.28 118.43,82.23 A07.V2 119.38,81.92 119.38,78.74 146.69,51.44 146.69,48.9 147.32,48.26 B05.H2
  Bottom 0.254: B05.H2 148.27,47.31 152.4,47.31 160.34,39.37 180.97,39.37 181.93,38.42 B02.L2
BAC9
  Top 0.254: 134.94,55.88 133.99,56.83 132.4,56.83 B06.D2 | 134.94,55.88 139.7,51.12 143.83,51.12 B05.F2 | 134.94,55.88 124.78,55.88 123.83,56.83 119.7,56.83 B07.D2
  Bottom 0.254: B02.P2 185.1,28.89 180.97,28.89 173.04,36.83 156.53,36.83 144.78,48.58 144.78,50.16 B05.F2
BAC10
  Top 0.254: 133.35,52.7 127.95,52.7 127,53.66 122.87,53.66 B07.E2 | 133.35,52.7 134.3,53.66 B06.E2 | 133.35,52.7 144.15,41.91 144.15,38.73 B05.L2
  Bottom 0.254: B02.R2 181.93,25.72 177.8,25.72 176.85,26.67 158.75,26.67 147.64,37.78 145.1,37.78 B05.L2
BAC11
  Top 0.254: 135.89,46.35 135.25,46.99 B06.H2 | 135.89,46.35 136.21,46.04 136.21,31.75 144.15,23.81 144.15,19.68 B05.T2 | 135.89,46.35 127.95,46.35 127,47.31 122.87,47.31 B07.H2
  Bottom 0.254: B02.M2 186.06,34.29 186.06,32.38 190.18,28.26 190.18,15.88 180.97,6.67 180.97,2.54 180.34,1.91 163.51,1.91 146.69,18.73 145.1,18.73 B05.T2
BMB3
  Top 0.254: B11.E2 72.07,53.66 76.2,53.66 77.15,52.7 82.55,52.7 83.5,53.66 B10.E2 84.45,54.61 84.45,58.74 89.22,63.5 89.22,99.69 96.52,107 96.52,110.49 A09.K2
  Bottom 0.254: A09.K2 97.47,111.44 101.6,111.44 102.55,112.39 133.35,112.39 134.3,111.44 A08.K2
BMB4
  Top 0.254: B11.H2 72.07,47.31 76.2,47.31 77.15,46.35 82.55,46.35 83.5,47.31 B10.H2 84.45,48.26 84.45,51.44 101.6,68.58 101.6,90.17 97.16,94.61 97.16,97.79 A09.P2
  Bottom 0.254: A09.P2 97.47,98.74 100.65,98.74 102.23,100.33 132.72,100.33 134.3,98.74 A08.P2
BMB5
  Top 0.254: B11.K2 72.07,40.96 76.2,40.96 77.15,40.01 82.55,40.01 83.5,40.96 B10.K2
  Bottom 0.254: 93.34,87.31 93.34,85.41 86.04,78.11 86.04,57.78 71.75,43.5 71.75,41.91 B11.K2 | 93.34,87.31 93.34,88.27 A09.T2 | 93.34,87.31 79.69,100.97 79.69,121.28 80.33,121.92 81.6,121.92 93.66,109.86 131.76,109.86 149.54,92.08 149.54,84.77 146.05,81.28 143.83,81.28 136.53,88.58 132.4,88.58 A08.T2
BMB6
  Top 0.254: B11.M2 72.07,34.61 76.2,34.61 77.15,33.66 82.55,33.66 83.5,34.61 B10.M2 84.45,35.56 84.45,39.69 92.39,47.62 92.39,55.56 93.34,56.52 B09.D2
  Bottom 0.254: B09.D2 94.3,56.83 98.42,56.83 99.38,55.88 104.78,55.88 105.73,56.83 B08.D2
BMB7
  Top 0.254: B11.P2 72.07,28.26 76.2,28.26 77.15,27.3 82.55,27.3 83.5,28.26 B10.P2 84.45,29.21 84.45,33.34 98.42,47.31 | 98.42,47.31 101.6,47.31 102.55,46.35 107.95,46.35 108.9,47.31 B08.H2 | 98.42,47.31 97.47,47.31 B09.H2
BMB8
  Top 0.254: B11.S2 72.07,21.91 76.2,21.91 77.15,20.95 82.55,20.95 83.5,21.91 B10.S2 84.77,22.54 86.36,22.54 98.42,34.61 | 98.42,34.61 101.6,34.61 102.55,33.66 107.95,33.66 108.9,34.61 B08.M2 | 98.42,34.61 97.47,34.61 B09.M2
CLRAC
  Top 0.254: B14.P2 33.97,28.26 38.1,28.26 39.05,27.3 44.45,27.3 45.4,28.26 B13.P2
  Bottom 0.254: A05.P2 147.32,99.06 147.32,101.6 123.83,125.09 81.6,125.09 57.47,100.97 57.47,85.09 61.28,81.28 62.87,81.28 73.34,70.8 73.34,57.78 46.35,30.8 46.35,29.21 B13.P2
DPI
  Bottom 0.254: B03.E2 173.67,54.29 177.8,54.29 179.39,55.88 183.2,55.88 183.83,56.52 183.83,57.78 176.21,65.41 166.05,65.41 158.43,73.03 158.43,119.06 157.48,120.02 A04.F2
DPO
  Top 0.254: B03.P2 173.35,29.21 173.35,33.34 184.47,44.45 184.47,54.61 185.1,55.24 196.85,55.24 197.8,54.29 B01.E2
GND  (1 unrouted)
  pour GND$: -40.32,0 206.38,0 206.38,149.22 -40.32,149.22
IC04
  Top 0.254: B15.H2 20,47.94 18.41,47.94 6.35,60.01 6.35,79.69 31.11,104.46 32.7,104.46 A14.M2
  Bottom 0.254: A13.M2 45.4,104.46 41.27,104.46 40.32,103.5 34.92,103.5 33.97,104.46 A14.M2
IC05
  Top 0.254: 33.02,97.16 33.02,97.79 A14.P2 | 33.02,97.16 33.02,96.2 16.19,79.38 16.19,56.52 17.14,55.56 17.14,51.44 B15.F2 | 33.02,97.16 40.32,97.16 41.27,98.11 45.4,98.11 A13.P2
IC06
  Top 0.254: 30.16,90.81 31.11,91.76 32.7,91.76 A14.S2 | 30.16,90.81 28.26,88.9 28.26,66.04 20.95,58.74 20.95,54.61 B15.E2 | 30.16,90.81 40.32,90.81 41.27,91.76 45.4,91.76 A13.S2
IC07
  Top 0.254: 29.21,87.63 29.84,88.27 A14.T2 | 29.21,87.63 28.89,87.31 28.89,60.33 21.27,52.7 20,52.7 17.78,54.93 17.78,56.52 B15.D2 | 29.21,87.63 37.15,87.63 38.1,88.58 42.23,88.58 A13.T2
IC08
  Top 0.254: 39.69,81.28 41.27,81.28 42.23,82.23 A13.V2 | 39.69,81.28 35.88,81.28 34.92,82.23 30.8,82.23 A14.V2 | 39.69,81.28 47.31,88.9 47.31,99.06 46.67,99.69 32.7,99.69 22.23,89.22 18.1,89.22 A15.T2
IC09
  Top 0.254: B14.D2 30.8,56.83 34.92,56.83 35.88,55.88 41.27,55.88 42.23,56.83 B13.D2
  Bottom 0.254: A15.U2 20.95,85.09 20.95,78.11 28.89,70.17 28.89,58.74 29.84,57.78 B14.D2
IC10
  Bottom 0.254: 34.61,53.66 38.1,53.66 39.05,52.7 44.45,52.7 45.4,53.66 B13.E2 | 34.61,53.66 33.97,53.66 B14.E2 | 34.61,53.66 34.61,80.01 18.1,96.52 16.83,96.52 16.19,95.89 16.19,88.27 17.14,87.31 17.14,83.19 A15.V2
IC11
  Bottom 0.254: B13.H2 45.4,47.94 44.45,48.9 39.05,48.9 38.1,47.94 33.97,47.94 B14.H2 33.02,48.26 32.07,49.21 32.07,76.2 17.78,90.49 17.78,94.61 A15.R2
INT
  Top 0.254: 44.77,33.97 45.4,34.61 B13.M2 | 44.77,33.97 44.45,33.66 39.05,33.66 38.1,34.61 33.97,34.61 B14.M2 | 44.77,33.97 44.77,57.15 41.27,60.64 41.27,76.52 47.94,83.19 47.94,99.38 41.27,106.05 31.75,106.05 24.45,98.74 21.27,98.74 A15.P2
  Bottom 0.254: A05.L2 144.15,108.58 144.15,110.17 128.59,125.73 75.25,125.73 49.21,99.69 22.23,99.69 21.27,98.74 A15.P2
IOP1
  Top 0.254: A11.D2 68.9,126.68 73.03,126.68 73.98,125.73 79.38,125.73 80.33,126.68 A10.D2 81.28,126.36 81.28,122.24 85.41,118.11 85.41,97.79 82.87,95.25 82.87,86.36 66.99,70.48 66.99,50.16 71.44,45.72 84.14,45.72 91.76,53.34 91.76,57.15 93.03,58.42 107,58.42 124.46,40.96 | 124.46,40.96 127,40.96 127.95,40.01 133.35,40.01 134.3,40.96 B06.K2 | 124.46,40.96 122.87,40.96 B07.K2
IOP2
  Top 0.254: 82.23,109.86 82.55,109.86 83.5,110.81 A10.K2 | 82.23,109.86 77.15,109.86 76.2,110.81 72.07,110.81 A11.K2 | B06.M2 134.3,34.61 133.35,33.66 127.95,33.66 127,34.61 122.87,34.61 B07.M2 121.6,35.24 120.65,36.2 96.2,36.2 84.14,24.13 73.98,24.13 66.36,31.75 66.36,72.39 82.23,88.27 82.23,95.89 79.69,98.42 79.69,102.23 82.23,104.78 82.23,109.86
IOP4
  Top 0.254: B07.P2 122.87,28.26 127,28.26 127.95,27.3 133.35,27.3 134.3,28.26 B06.P2 | A11.R2 68.9,94.93 73.03,94.93 73.98,93.98 79.38,93.98 80.33,94.93 A10.R2
  Bottom 0.254: B07.P2 121.6,28.89 117.47,28.89 115.89,30.48 80.33,30.48 70.17,40.64 70.17,49.85 79.69,59.37 79.69,93.66 80.64,94.61 A10.R2
IOSKP
  Top 0.254: A15.N2 18.1,101.92 20,101.92 27.3,109.22 56.2,109.22 56.83,108.58 56.83,92.08 50.8,86.04 50.8,47.94 46.35,43.5 46.35,41.91 B13.K2 | A05.D2 145.1,127.32 149.22,127.32 150.18,128.27 158.75,128.27 203.2,83.82 203.2,12.06 192.41,1.27 26.99,1.27 16.19,12.06 16.19,22.23 33.02,39.05 33.02,40.64 B14.K2
  Bottom 0.254: B14.K2 33.97,40.96 38.1,40.96 39.05,40.01 41.91,40.01 42.86,40.96 45.4,40.96 B13.K2
IOTXY2
  Top 0.254: A15.D2 18.1,126.68 22.23,126.68 33.34,115.57 53.98,115.57 54.93,114.62 A12.J2 56.2,113.98 57.78,113.98 63.5,108.27 67.63,108.27 A11.L2
IOTXY4
  Top 0.254: A12.T2 56.2,89.22 60.33,89.22 61.91,90.81 69.85,90.81 70.8,91.76 A11.S2
  Bottom 0.254: B15.T2 18.1,19.37 22.23,19.37 30.16,27.3 46.67,27.3 75.88,56.52 75.88,85.72 71.75,89.85 71.75,91.44 A11.S2
IOTXZ2
  Top 0.254: A12.S2 59.05,92.71 59.05,94.3 68.26,103.5 74.61,103.5 78.74,107.63 80.33,107.63 A10.L2
  Bottom 0.254: A05.U2 147,86.04 143.83,86.04 130.18,99.69 102.55,99.69 100.01,97.16 93.66,97.16 83.19,107.63 81.6,107.63 A10.L2
IOTXZ4
  Top 0.254: A10.S2 84.45,92.71 84.45,95.89 94.93,106.36 94.93,111.12 96.2,112.39 97.47,112.39 98.74,111.12 98.74,93.98 105.09,87.63 105.09,75.56 122.24,58.42 138.75,58.42 145.73,51.44 145.73,47.62 143.19,45.09 143.19,43.81 143.83,43.18 146.05,43.18 149.54,46.67 149.54,51.75 147.96,53.34 B05.E2 147.32,54.61 147.32,56.2 123.51,80.01 123.51,80.96 113.67,90.81 108.9,90.81 105.09,94.61 105.09,106.68 80.33,131.44 69.85,131.44 66.36,127.95 66.36,111.76 69.53,108.58 69.53,107.31 68.9,106.68 65.09,106.68 63.5,105.09 59.37,105.09 A12.M2
N$1
  Top 0.254: A10.V2 81.6,82.87 83.82,85.09 A10.U2
N$2
  Top 0.254: A16.F2 5.08,120.02 7.3,117.79 A16.H2
N$3
  Top 0.254: A16.R2 4.45,95.89 4.45,100.01 3.49,100.97 3.49,106.36 4.45,107.31 A16.L2
  Bottom 0.254: R1.1 5.08,146.05 13.02,146.05 14.29,147.32 14.92,147.32 15.88,146.37 15.88,129.54 3.49,117.16 3.49,109.54 4.45,108.58 A16.L2
N$4
  Top 0.254: A16.U2 7.3,86.04 5.08,88.27 A16.T2
  Bottom 0.254: R1.2 14.61,145.41 14.61,138.75 2.86,127 2.86,91.12 4.45,89.53 A16.T2
N$5
  Top 0.254: A10.J2 81.6,114.62 83.82,116.84 A10.H2
N$6
  Top 0.254: B04.H2 159.7,47.94 157.48,50.16 B04.F2
N$7
  Top 0.254: 155.89,23.81 155.89,12.06 156.84,11.11 156.84,3.81 R2.1 | 155.89,23.81 156.84,24.77 B04.R2 | 155.89,23.81 155.89,32.38 156.84,33.34 156.84,37.47 B04.L2
N$8
  Top 0.254: R2.2 167,3.81 167,7.3 160.66,13.65 160.66,15.24 B04.U2 159.7,16.19 157.48,18.41 B04.T2
N$9
  Top 0.254: A11.V2 68.9,82.87 71.12,85.09 A11.U2
N$10
  Top 0.254: A11.J2 68.9,114.62 71.12,116.84 A11.H2
N$11
  Top 0.254: A10.N2 81.28,100.97 83.5,98.74 A10.P2
N$12
  Top 0.254: A11.N2 68.58,100.97 70.8,98.74 A11.P2
N$13
  Top 0.254: A04.S2 160.02,92.71 160.02,97.79 A04.P2
N$14
  Top 0.254: A04.V2 156.84,83.19 156.84,87.31 155.89,88.27 155.89,93.66 156.84,94.61 A04.R2
N$15
  Bottom 0.254: J1.2 180.02,3.81 180.02,7.3 187.64,14.92 187.64,29.84 183.83,33.66 183.83,38.73 182.56,40.01 172.4,40.01 171.77,40.64 171.77,54.61 175.58,58.42 180.97,58.42 181.93,57.47 B02.D2
N$16
  Top 0.254: B01.H2 197.8,47.94 195.58,50.16 B01.F2
N$17
  Top 0.254: J2.2 192.09,3.81 192.09,13.97 187.01,19.05 187.01,52.39 186.06,53.34 B02.E2
PSM
  Top 0.254: A05.H2 148.27,117.79 149.86,117.79 156.84,124.78 156.84,126.36 A04.D2 157.8,126.68 159.38,126.68 193.68,92.39 193.68,66.99 196.53,64.14 196.53,62.87 192.09,58.42 169.23,58.42 168.59,57.78 168.59,41.27 | 168.59,41.27 168.59,12.06 169.23,11.43 169.23,3.81 J1.1 | 168.59,41.27 172.72,45.4 172.72,46.99 B03.H2
RCLO
  Top 0.254: B15.S2 20.95,22.86 20.95,26.04 34.61,39.69 34.61,41.91 30.16,46.35 19.05,46.35 2.86,62.55 2.86,124.78 4.45,126.36 A16.D2 5.4,127.32 6.35,128.27 49.85,128.27 50.8,127.32 54.93,127.32 A12.D2
RRE
  Top 0.254: B03.M2 172.72,34.29 172.72,30.16 171.13,28.57 171.13,2.86 170.18,1.91 156.53,1.91 148.91,9.53 148.91,25.4 143.19,31.11 143.19,34.92 152.08,43.81 152.08,52.39 124.14,80.33 124.14,98.42 119.06,103.5 108.9,103.5 107.63,104.78 107.63,108.58 84.14,132.08 68.9,132.08 65.72,128.91 4.76,128.91 1.59,125.73 1.59,55.88 17.14,40.32 17.14,38.73 B15.L2
TCLO
  Bottom 0.254: 152.4,55.88 155.57,55.88 156.53,56.83 B04.D2 | 152.4,55.88 150.18,55.88 149.22,56.83 145.1,56.83 B05.D2 | 152.4,55.88 152.4,90.17 146.37,96.2 146.37,101.6 125.41,122.56 80.01,122.56 79.06,121.6 79.06,110.49 59.05,90.49 59.05,86.36 A12.U2
TSO
  Top 0.254: B03.D2 170.5,56.83 174.62,56.83 175.58,55.88 193.68,55.88 194.63,56.83 B01.D2
  Bottom 0.254: B01.D2 194.94,56.52 193.99,55.56 193.99,15.88 182.56,4.45 182.56,3.81 J2.1 181.93,2.54 180.66,1.27 33.34,1.27 6.03,28.57 6.03,89.53 3.49,92.08 3.49,95.89 6.03,98.42 6.03,118.75 18.73,131.44 18.73,136.53 20,137.79 21.27,137.79 21.91,137.16 21.91,129.54 17.78,125.41 17.78,121.28 A15.F2
VCC  (2 unrouted)
  Top 0.508: B05.A2 148.27,66.36 152.4,66.36 153.67,65.09 158.43,65.09 159.7,66.36 B04.A2 160.97,66.36 165.1,66.36 166.37,65.09 171.13,65.09 172.4,66.36 B03.A2 | 158.59,135.1 159.7,136.21 A04.A2 | 158.59,135.1 158.43,134.94 153.67,134.94 152.4,136.21 148.27,136.21 A05.A2 | A03.A2 172.4,136.21 168.28,136.21 167,134.94 158.75,134.94 158.59,135.1 | B11.A2 72.07,66.36 76.2,66.36 77.47,65.09 82.23,65.09 83.5,66.36 B10.A2 | 18.89,135.1 20,136.21 A15.A2 | 18.89,135.1 18.73,134.94 13.97,134.94 12.7,136.21 8.57,136.21 A16.A2 | 57.15,134.94 65.41,134.94 66.67,136.21 70.8,136.21 A11.A2 | 57.15,134.94 19.05,134.94 18.89,135.1 | A12.A2 58.74,134.94 57.15,134.94
  Bottom 0.508: 185.58,57.31 187.32,59.05 187.32,60.01 | 185.58,57.31 173.35,45.09 173.35,41.91 B03.K2 | 187.32,60.01 187.32,64.77 186.06,66.04 B02.A2 | 185.58,57.31 185.42,57.47 176.53,66.36 173.67,66.36 B03.A2 172.72,67.31 172.72,84.14 171.45,85.41 171.45,134.62 172.72,135.89 A03.A2 | 187.32,60.01 193.68,66.36 197.8,66.36 B01.A2 | 82.39,135.1 83.5,136.21 A10.A2 | 82.39,135.1 82.23,134.94 77.47,134.94 76.2,136.21 72.07,136.21 A11.A2 | 20.32,69.22 20.32,75.88 6.67,89.53 6.67,91.44 6.35,91.76 6.35,94.93 12.7,101.28 12.7,124.46 20.32,132.08 20.32,135.89 A15.A2 | 20.32,69.22 20.32,67.31 B15.A2 | 20.32,69.22 12.7,61.59 12.7,47.31 17.14,42.86 49.53,42.86 71.12,64.45 71.12,66.04 B11.A2 | A05.A2 147,136.21 142.88,136.21 141.6,134.94 82.55,134.94 82.39,135.1